# EAGLE schematic WIZnet-IoT-iOffload-Contest (EAGLE 7.7.0)
AUTHOR: Clemens Valens; DATE: August 2019
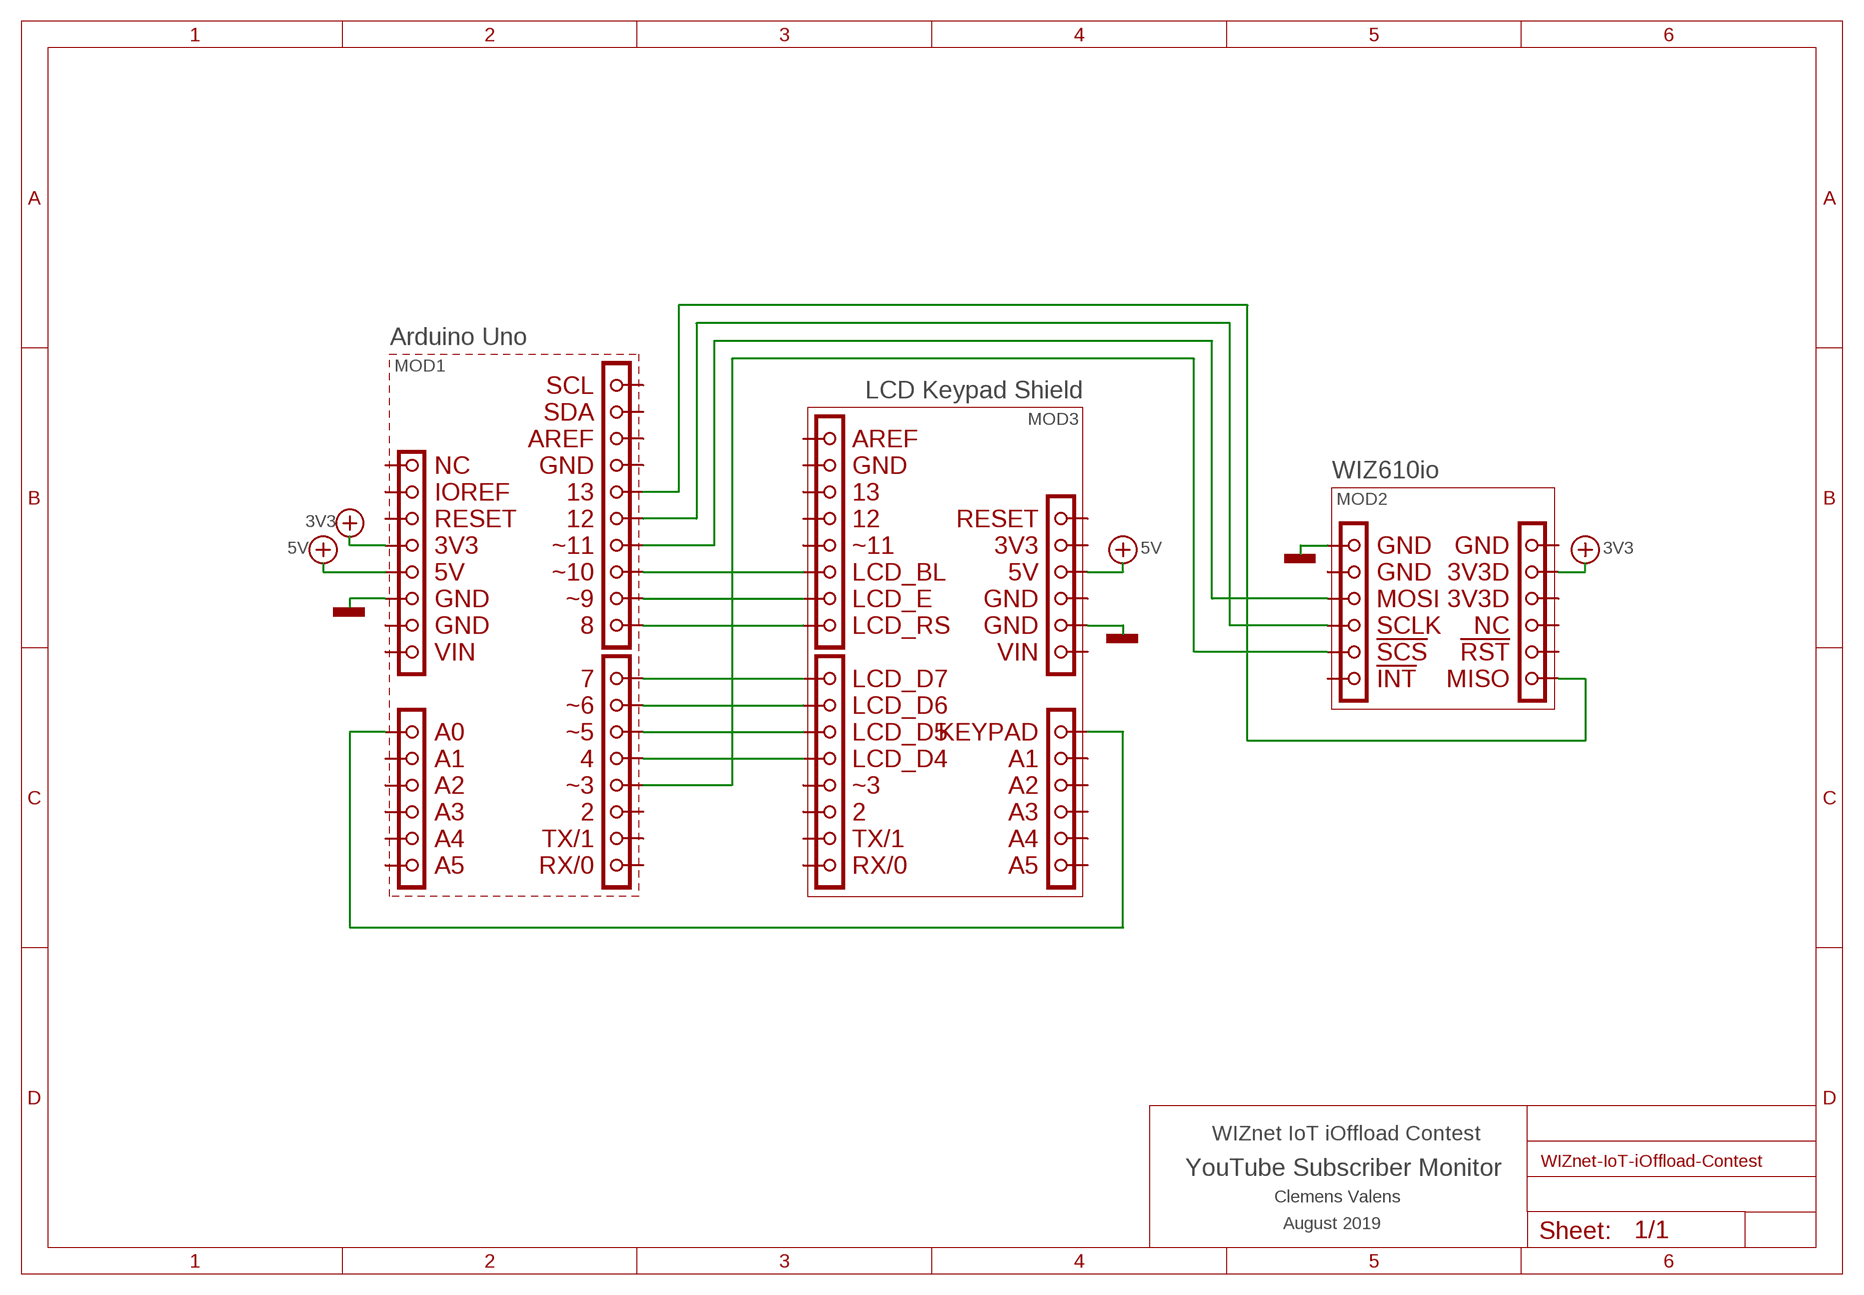
[diagram p0: schematic, sheet 1]

## Parts
MOD1  Arduino Uno  ARDUINO_UNO  [DUEMILANOVE_VIAS]
MOD2  WIZ610io  WIZ610IO  [WIZ610IO]
MOD3  LCD Keypad Shield  LCD_KEYPAD_SHIELD  [ARDUINO_SHIELD_V0]

## Nets
3V3: MOD1.3.3V MOD2.11
5V: MOD1.5V MOD3.5V
!SCS!: MOD1.D3 MOD2.5
GND: MOD1.GND@0 MOD2.1 MOD3.GND@21(GND)
LCD_BL: MOD1.D10 MOD3.D10
LCD_D4: MOD1.D4 MOD3.D4
LCD_D5: MOD1.D5 MOD3.D5
LCD_D6: MOD1.D6 MOD3.D6
LCD_D7: MOD1.D7 MOD3.D7
LCD_E: MOD1.D9 MOD3.D9
LCD_RS: MOD1.D8 MOD3.D8
MISO: MOD1.D13 MOD2.7
MOSI: MOD1.D11 MOD2.3
N$8: MOD1.A0 MOD3.A0
SCLK: MOD1.D12 MOD2.4
Unconnected: MOD1.A1 MOD1.A2 MOD1.A3 MOD1.A4 MOD1.A5 MOD1.AREF MOD1.D0 MOD1.D1 MOD1.D2 MOD1.GND@1 MOD1.GND@2 MOD1.IOREF MOD1.NC MOD1.RES MOD1.SCL MOD1.SDA MOD1.VIN MOD2.2 MOD2.6 MOD2.8 MOD2.9 MOD2.10 MOD2.12 MOD3.3.3V(3V3) MOD3.A1 MOD3.A2 MOD3.A3 MOD3.A4 MOD3.A5 MOD3.AREF MOD3.D0 MOD3.D1 MOD3.D2 MOD3.D3 MOD3.D11 MOD3.D12 MOD3.D13 MOD3.GND@14(GND) MOD3.GND@22(GND) MOD3.RES(RESET) MOD3.VIN

## Notes on the sheet
- WIZnet IoT iOffload Contest
- YouTube Subscriber Monitor

## Library data of the parts
MOD1 = _Elektor2:ARDUINO_UNO: Arduino Uno R3
MOD2 = WIZnet-IoT-iOffload-Contest:WIZ610IO: WIZnet WIZ610io Ethernet module.
MOD3 = WIZnet-IoT-iOffload-Contest:LCD_KEYPAD_SHIELD: LCD Keypad Shield V1